# Altium schematic sheet PB2_MFB_Butterworth.SchDoc
size A4
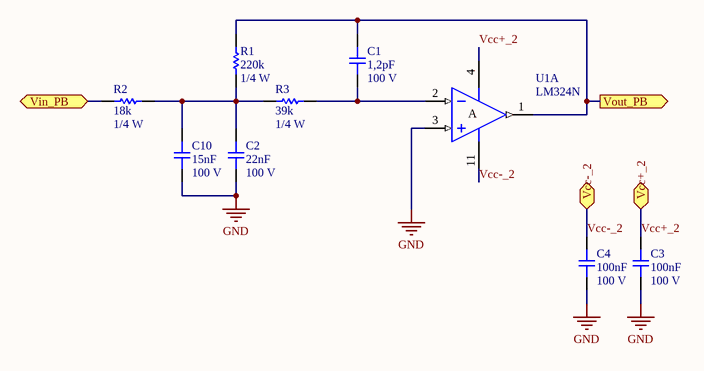
[diagram p0: PB2_MFB_Butterworth.SchDoc]

## Parts
C1  1,2pF  Voltage: 100 V  [0805C]
C2  22nF  Voltage: 100 V  [0805C]
C3  100nF  Voltage: 100 V  [0805C]
C4  100nF  Voltage: 100 V  [0805C]
C10  15nF  Voltage: 100 V  [0805C]
R1  220k  Power: 1/4 W  [0805R]
R2  18k  Power: 1/4 W  [0805R]
R3  39k  Power: 1/4 W  [0805R]
U1  LM324N  [N014]  (part A of 4)

## Ports
Vcc+_2, Vcc-_2, Vin_PB, Vout_PB (out)

## Nets
GND: C2.1 C3.1 C4.1 C10.1 U1.3(IN+)
Vcc+_2: C3.2 U1.4(V+) ; port Vcc+_2
Vcc-_2: C4.2 U1.11(V-) ; port Vcc-_2
Vin_PB: R2.1 ; port Vin_PB
Vout_PB: C1.2 R1.2 U1.1(OUT) ; port Vout_PB
NetC1_1: C1.1 R3.2 U1.2(IN-)
NetC2_2: C2.2 C10.2 R1.1 R2.2 R3.1

## Notes on the sheet
- (in symbol LM324N, part A) A

## Library data of the parts
C1-C4 C10 = Capacitor: Published: 8-Jun-2000; LatestRevisionDate: 17-Jul-2002; LatestRevisionNote: Re-released for DXP Platform.; PackageReference: RAD-0.3; Publisher: Altium Limited
R1-R3 = Resistor: Tolerance: 5%; Published: 8-Jun-2000; LatestRevisionDate: 17-Jul-2002; LatestRevisionNote: Re-released for DXP Platform.; PackageReference: AXIAL-0.3; Publisher: Altium Limited
U1 = LM324N: Quadruple Operational Amplifier; Published: 16-Jan-2001; LatestRevisionDate: 04-Mar-2005; LatestRevisionNote: Stylized 3D Model Added.; DatasheetVersion: Feb-1997; PackageVersion: Oct-1995; PackageReference: N014; Publisher: Altium Limited; PackageDescription: DIP; 14 Leads; Row Spacing 7.62 mm; Pitch 2.54 mm; ComponentLink1Description: Manufacturer Link; ComponentLink1URL: http://www.ti.com/; ComponentLink2Description: Datasheet; ComponentLink2URL: http://www-s.ti.com/sc/ds/lm324.pdf